# Altium schematic sheet MercurialSDR_FPGA_Programming_&_Power.SchDoc
size A4
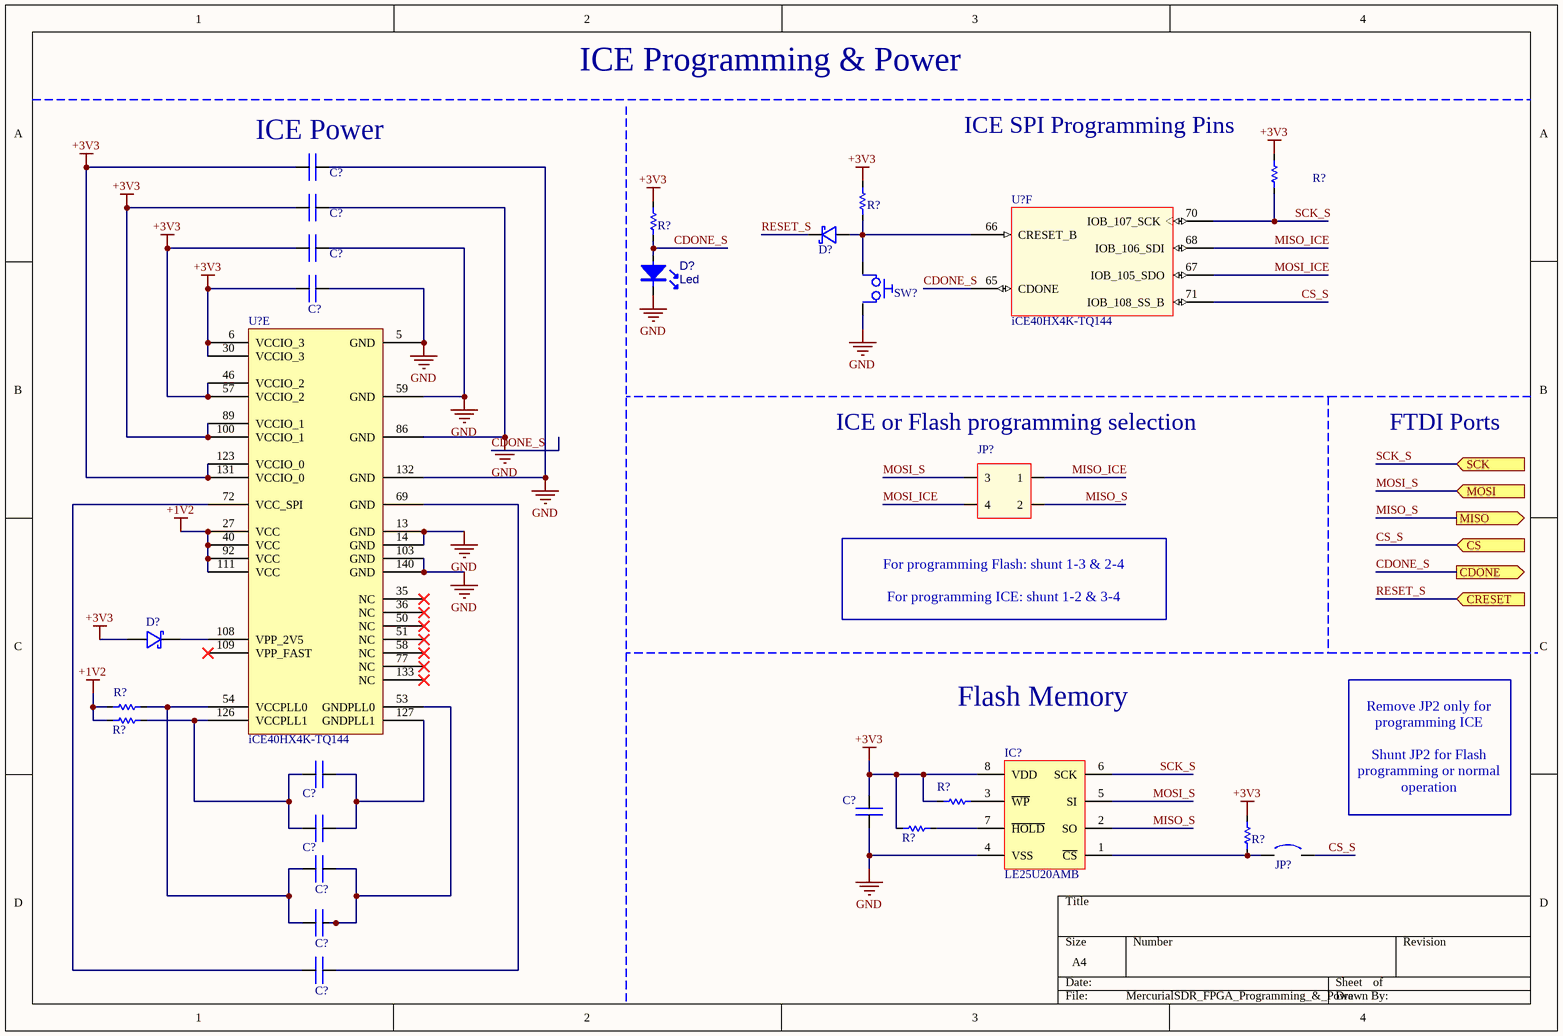
[diagram p0: MercurialSDR_FPGA_Programming_&_Power.SchDoc]

## Parts
(Parts that share a designator on the sheet are numbered #1, #2 ... from top to bottom, then left to right.)
C?#1  Capacitor  [CAP_0603]  (value not drawn)
C?#2  Capacitor  [CAP_0603]  (value not drawn)
C?#3  Capacitor  [CAP_0603]  (value not drawn)
C?#4  Capacitor  [CAP_0603]  (value not drawn)
C?#5  Capacitor  [CAP_0603]  (value not drawn)
C?#6  Capacitor  [CAP_0603]  (value not drawn)
C?#7  Capacitor  [CAP_0603]  (value not drawn)
C?#8  Capacitor  [CAP_0603]  (value not drawn)
C?#9  Capacitor  [CAP_0603]  (value not drawn)
C?#10  Capacitor  [CAP_0603]  (value not drawn)
D?#1  Schottky Diode  (value not drawn)
D?#2  Led
D?#3  Schottky Diode  [SOD-523F]  (value not drawn)
IC?  LE25U20AMB  [SOIC-8]
JP?#1  Jumper  [Jumper 2x2]  (value not drawn)
JP?#2  Jumper  [Jumper 2x1]  (value not drawn)
R?#1  Resistor SMD  [RES_0603]  (value not drawn)
R?#2  Resistor SMD  [RES_0603]  (value not drawn)
R?#3  Resistor SMD  [RES_0603]  (value not drawn)
R?#4  Resistor SMD  [RES_0603]  (value not drawn)
R?#5  Resistor SMD  [RES_0603]  (value not drawn)
R?#6  Resistor SMD  [RES_0603]  (value not drawn)
R?#7  Resistor SMD  [RES_0603]  (value not drawn)
R?#8  Resistor SMD  [RES_0603]  (value not drawn)
SW?  Pulsador  (value not drawn)
U?#1  iCE40HX4K-TQ144  [LATC-TQFP-144_L]  (part F of 6)
U?#2  iCE40HX4K-TQ144  [LATC-TQFP-144_L]  (part E of 6)

## Ports
CDONE (out), CRESET (in), CS (in), MISO (out), MOSI (in), SCK (in)

## Nets
+1V2: R?#4.2 R?#5.2 U?#2.27(VCC) U?#2.40(VCC) U?#2.92(VCC) U?#2.111(VCC)
+3V3: C?#1.1 C?#2.1 C?#3.1 C?#4.1 C?#6.2 D?#3.1(A) IC?.8(VDD) R?#1.1 R?#2.1 R?#3.1 R?#6.1 R?#7.1 R?#8.2 U?#2.6(VCCIO_3) U?#2.30(VCCIO_3) U?#2.46(VCCIO_2) U?#2.57(VCCIO_2) U?#2.89(VCCIO_1) U?#2.100(VCCIO_1) U?#2.123(VCCIO_0) U?#2.131(VCCIO_0)
GND: C?#1.2 C?#2.2 C?#3.2 C?#4.2 C?#6.1 D?#2.2(K) IC?.4(VSS) SW?.4 U?#2.5(GND) U?#2.13(GND) U?#2.14(GND) U?#2.59(GND) U?#2.86(GND) U?#2.103(GND) U?#2.132(GND) U?#2.140(GND)
CDONE_S: D?#2.1(A) R?#3.2 U?#1.65(CDONE) ; port CDONE
CS_S: JP?#2.2 U?#1.71(IOB_108_SS_B) ; port CS
MISO_ICE: JP?#1.1 U?#1.68(IOB_106_SDI)
MISO_S: IC?.2(SO) JP?#1.2 ; port MISO
MOSI_ICE: JP?#1.4 U?#1.67(IOB_105_SDO)
MOSI_S: IC?.5(SI) JP?#1.3 ; port MOSI
RESET_S: D?#1.2(K) ; port CRESET
SCK_S: IC?.6(SCK) R?#1.2 U?#1.70(IOB_107_SCK) ; port SCK
NetC?#5_1: C?#5.1 C?#7.1 U?#2.127(GNDPLL1)
NetC?#5_2: C?#5.2 C?#7.2 R?#5.1 U?#2.126(VCCPLL1)
NetC?#8_1: C?#8.1 C?#9.1 U?#2.53(GNDPLL0)
NetC?#8_2: C?#8.2 C?#9.2 R?#4.1 U?#2.54(VCCPLL0)
NetC?#10_1: C?#10.1 U?#2.69(GND)
NetC?#10_2: C?#10.2 U?#2.72(VCC_SPI)
NetD?#1_1: D?#1.1(A) R?#2.2 SW?.1 U?#1.66(CRESET_B)
NetD?#3_2: D?#3.2(K) U?#2.108(VPP_2V5)
NetIC?_1: IC?.1(~{CS}) JP?#2.1 R?#8.1
NetIC?_3: IC?.3(~{WP}) R?#6.2
NetIC?_7: IC?.7(~{HOLD}) R?#7.2

Not connected (* = marked no-connect by the designer): SW? 2 3; U?#2 35(NC)* 36(NC)* 50(NC)* 51(NC)* 58(NC)* 77(NC)* 109(VPP_FAST)* 133(NC)*

## Notes on the sheet
- ICE Programming & Power
- (near C?#1) ICE Power
- (near R?#1) ICE SPI Programming Pins
- (near JP?#1) ICE or Flash programming selection
- FTDI Ports
- (near JP?#1) For programming Flash: shunt 1-3 & 2-4
  For programming ICE: shunt 1-2 & 3-4
- Flash Memory
- Remove JP2 only for programming ICE
  Shunt JP2 for Flash programming or normal operation

## Library data of the parts
C?#1-C?#10 = Cap: Capacitor no polarizado; Value: *; Temp Coef: *; Part Number: *; VR: *; Material: *
D?#1 D?#3 = Diodo_Schottky: Diodo Schottkey; Part Number: *; In: *; VR: *
IC? = LE25U20AMB: Flash Memmory SPI (256Kx8); Part Number: *
JP?#1 = Jumper 2x2
R?#1-R?#8 = Res: Resistor; Power: *; Part Number: *; Tolerance: *
U?#1 U?#2 = ICE40HX4K-TQ144: iCE40 HX4K Series FPGA Family, 3520 Logic Cells, 1.2 V Core, 80 K Embedded RAM Bits, 144-pin TQFP, Pb-Free, Tray; Manufacturer: Lattice Semiconductor; Phase-Locked Loops: 2; Supply Voltage: 1.2V; Logic Cells: 3520; Embedded RAM Bits: 80K; ComponentLink1Description: Manufacturer URL; ComponentLink2Description: Datasheet; DatasheetVersion: Rev. 02.9; Mounting Technology: Surface Mount; ComponentLink3URL: http://www.latticesemi.com/lit/docs/package/pkg.pdf; ComponentLink3Description: Package Specification; ComponentLink1URL: http://www.latticesemi.com/en; ComponentLink2URL: http://www.latticesemi.com/~/media/Documents/DataSheets/iCE/iCE40LPHXFamilyDataSheet.pdf; PackageReference: TQFP-144; Packing: Tray; PartNumber: ICE40HX4K-TQ144; PackageDescription: 144-Pin Thin Quad Flat Package, Body 20 x 20 mm, Pitch 0.5 mm; PackageVersion: Rev. 03.9, 02/2013; RoHS: TRUE
D?#2 = Led: Color: *; Part Number: *
JP?#2 = Jumper: Part Number: *